# EAGLE design C64_Userport_Test (EAGLE 9.5.2)
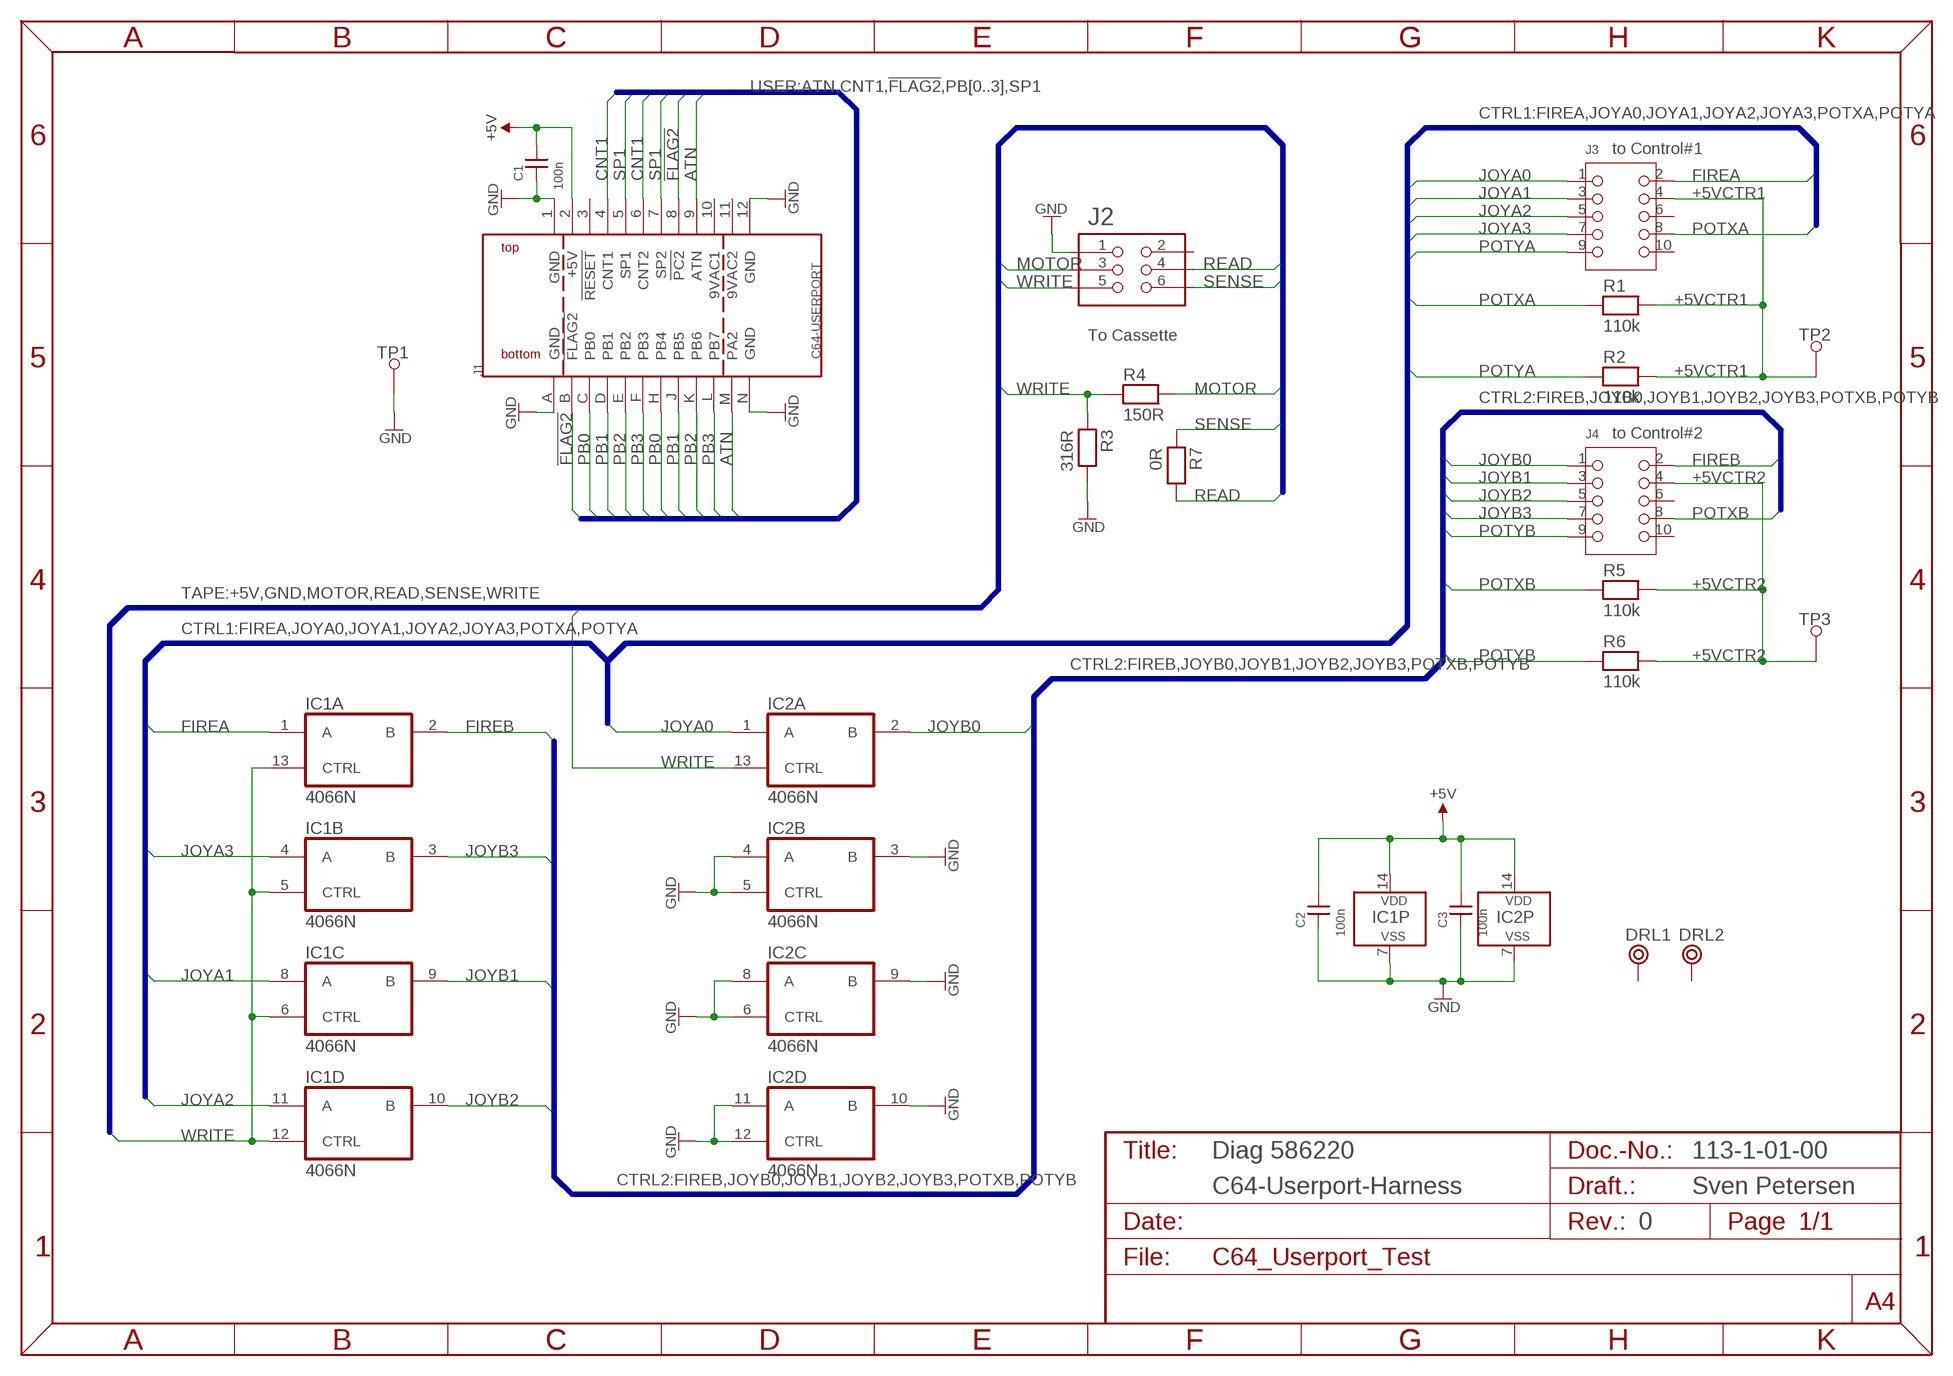
[diagram p0: schematic, sheet 1]

## Parts
C1  100n  CAP01  [C-2,5]
C2  100n  CAP01  [C-2,5]
C3  100n  CAP01  [C-2,5]
DRL1  BOHR3,2  [BOHR3,2]
DRL2  BOHR3,2  [BOHR3,2]
IC1  4066N  [DIL14]
IC2  4066N  [DIL14]
J1  C64-USERPORT  [USERPORT]
J2  2X03WV  [2X03WV]
J3  2X05WV  [2X05WV]
J4  2X05WV  [2X05WV]
R1  110k  RES04  [R-10]
R2  110k  RES04  [R-10]
R3  316R  RES04  [R-10]
R4  150R  RES04  [R-10]
R5  110k  RES04  [R-10]
R6  110k  RES04  [R-10]
R7  0R  RES04  [R-10]
TP1  L1,2_R  [1,2MM_R]
TP2  L1,2_R  [1,2MM_R]
TP3  L1,2_R  [1,2MM_R]

## Nets
!FLAG2: J1.8(!PC2) J1.B(!FLAG2)
+5V: C1.2 C2.2 C3.2 IC1.14(P:VDD) IC2.14(P:VDD) J1.2(+5V)
+5VCTR1: J3.4 R1.2 R2.2 TP2.1
+5VCTR2: J4.4 R5.2 R6.2 TP3.1
ATN: J1.9(ATN) J1.M(PA2)
CNT1: J1.4(CNT1) J1.6(CNT2)
FIREA: IC1.1(A:A) J3.2
FIREB: IC1.2(A:B) J4.2
GND: C1.1 C2.1 C3.1 IC1.7(P:VSS) IC2.3(B:B) IC2.4(B:A) IC2.5(B:CTRL) IC2.6(C:CTRL) IC2.7(P:VSS) IC2.8(C:A) IC2.9(C:B) IC2.10(D:B) IC2.11(D:A) IC2.12(D:CTRL) J1.1(GND) J1.12(GND) J1.A(GND) J1.N(GND) J2.1 R3.2 TP1.1
JOYA0: IC2.1(A:A) J3.1
JOYA1: IC1.8(C:A) J3.3
JOYA2: IC1.11(D:A) J3.5
JOYA3: IC1.4(B:A) J3.7
JOYB0: IC2.2(A:B) J4.1
JOYB1: IC1.9(C:B) J4.3
JOYB2: IC1.10(D:B) J4.5
JOYB3: IC1.3(B:B) J4.7
MOTOR: J2.3 R4.2
PB0: J1.C(PB0) J1.H(PB4)
PB1: J1.D(PB1) J1.J(PB5)
PB2: J1.E(PB2) J1.K(PB6)
PB3: J1.F(PB3) J1.L(PB7)
POTXA: J3.8 R1.1
POTXB: J4.8 R5.1
POTYA: J3.9 R2.1
POTYB: J4.9 R6.1
READ: J2.4 R7.2
SENSE: J2.6 R7.1
SP1: J1.5(SP1) J1.7(SP2)
WRITE: IC1.5(B:CTRL) IC1.6(C:CTRL) IC1.12(D:CTRL) IC1.13(A:CTRL) IC2.13(A:CTRL) J2.5 R3.1 R4.1
Unconnected: DRL1.P$1 DRL2.P$1 J1.3(!RESET) J2.2 J3.6 J3.10 J4.6 J4.10

## Buses
USER:ATN,CNT1,!FLAG2,PB[0..3],SP1
TAPE:+5V,GND,MOTOR,READ,SENSE,WRITE
CTRL1:FIREA,JOYA0,JOYA1,JOYA2,JOYA3,POTXA,POTYA
CTRL2:FIREB,JOYB0,JOYB1,JOYB2,JOYB3,POTXB,POTYB

## Notes on the sheet
- to Control#1
- To Cassette
- to Control#2
- Diag 586220 | 113-1-01-00
- C64-Userport-Harness | Sven Petersen
- 0

## Power pins joined to a net without a drawn wire
9VAC1: J1.10(9VAC1)
9VAC2: J1.11(9VAC2)

## Library data of the parts
C1-C3 = DISCRETE:CAP01
DRL1 DRL2 = Mech_Bohr:BOHR3,2
IC1 IC2 = 40xx:4066: Quad bilateral ANALOG SWITCH
J1 = Commodore:C64-USERPORT
J2 = PINHEAD:2X03WV
J3 J4 = PINHEAD:2X05WV
R1-R7 = DISCRETE:RES04
TP1-TP3 = Pads:L1,2_R

## Board
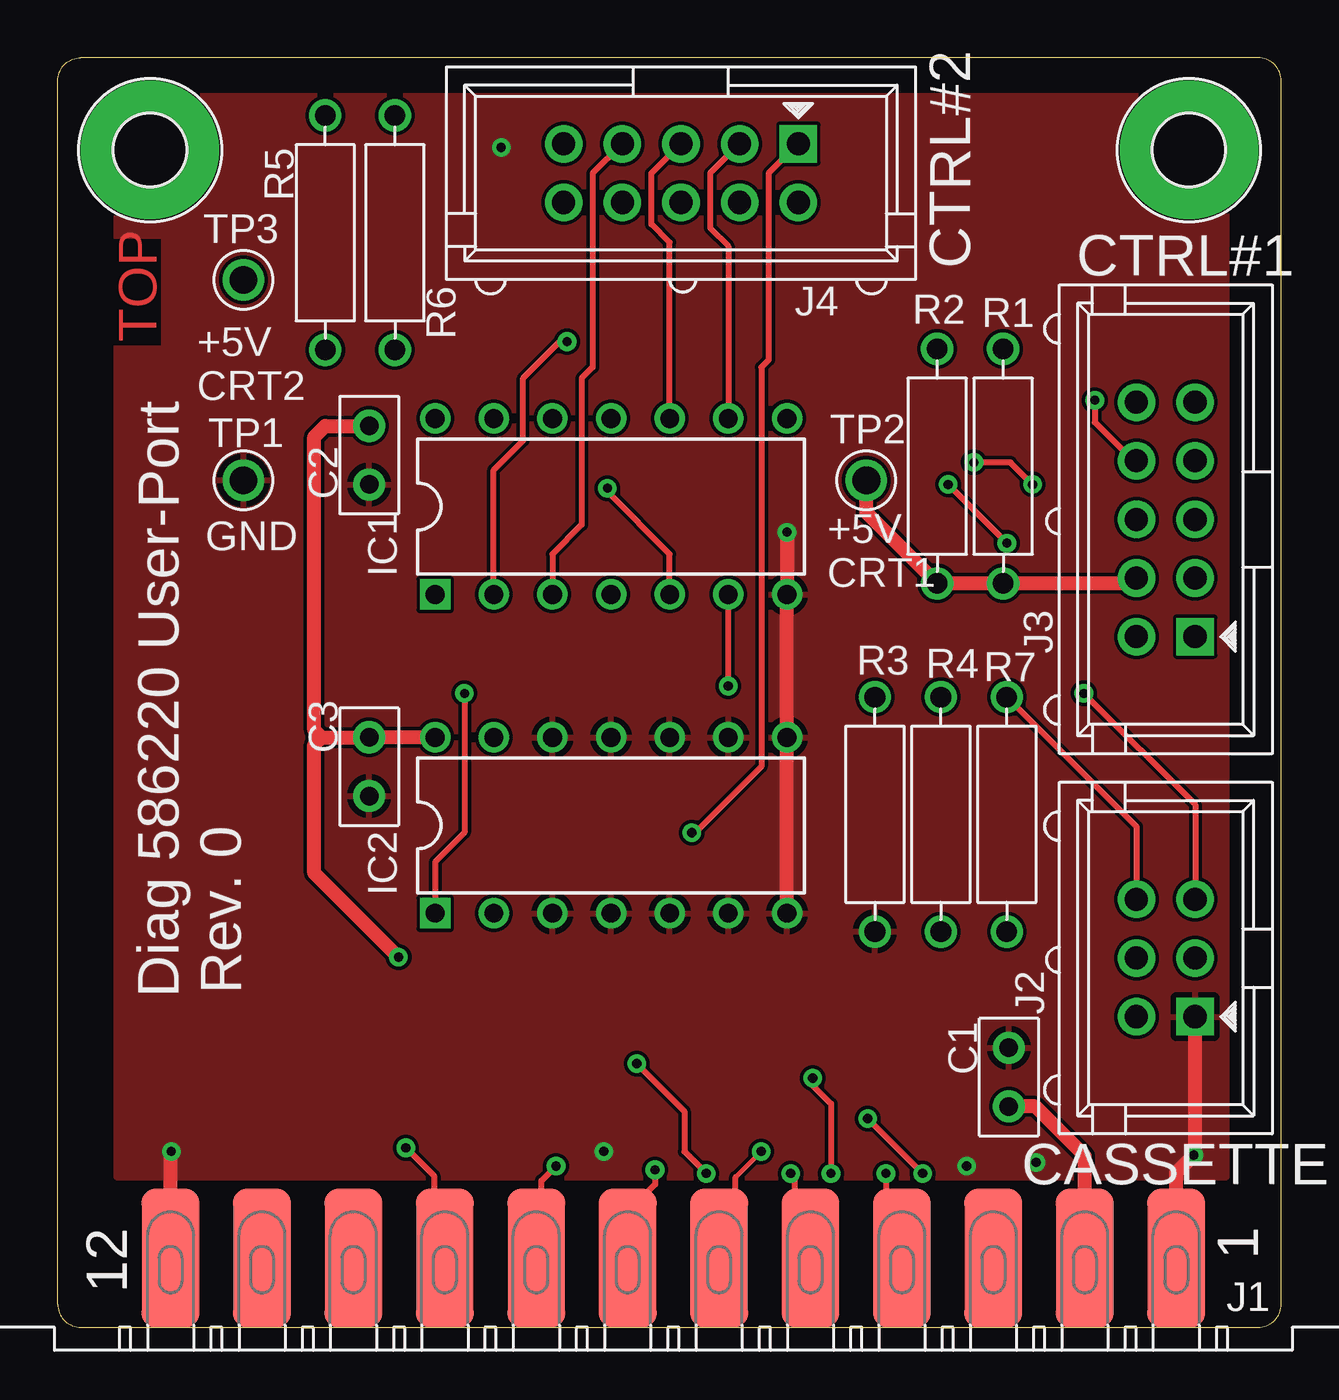
[diagram p1: board, top side]
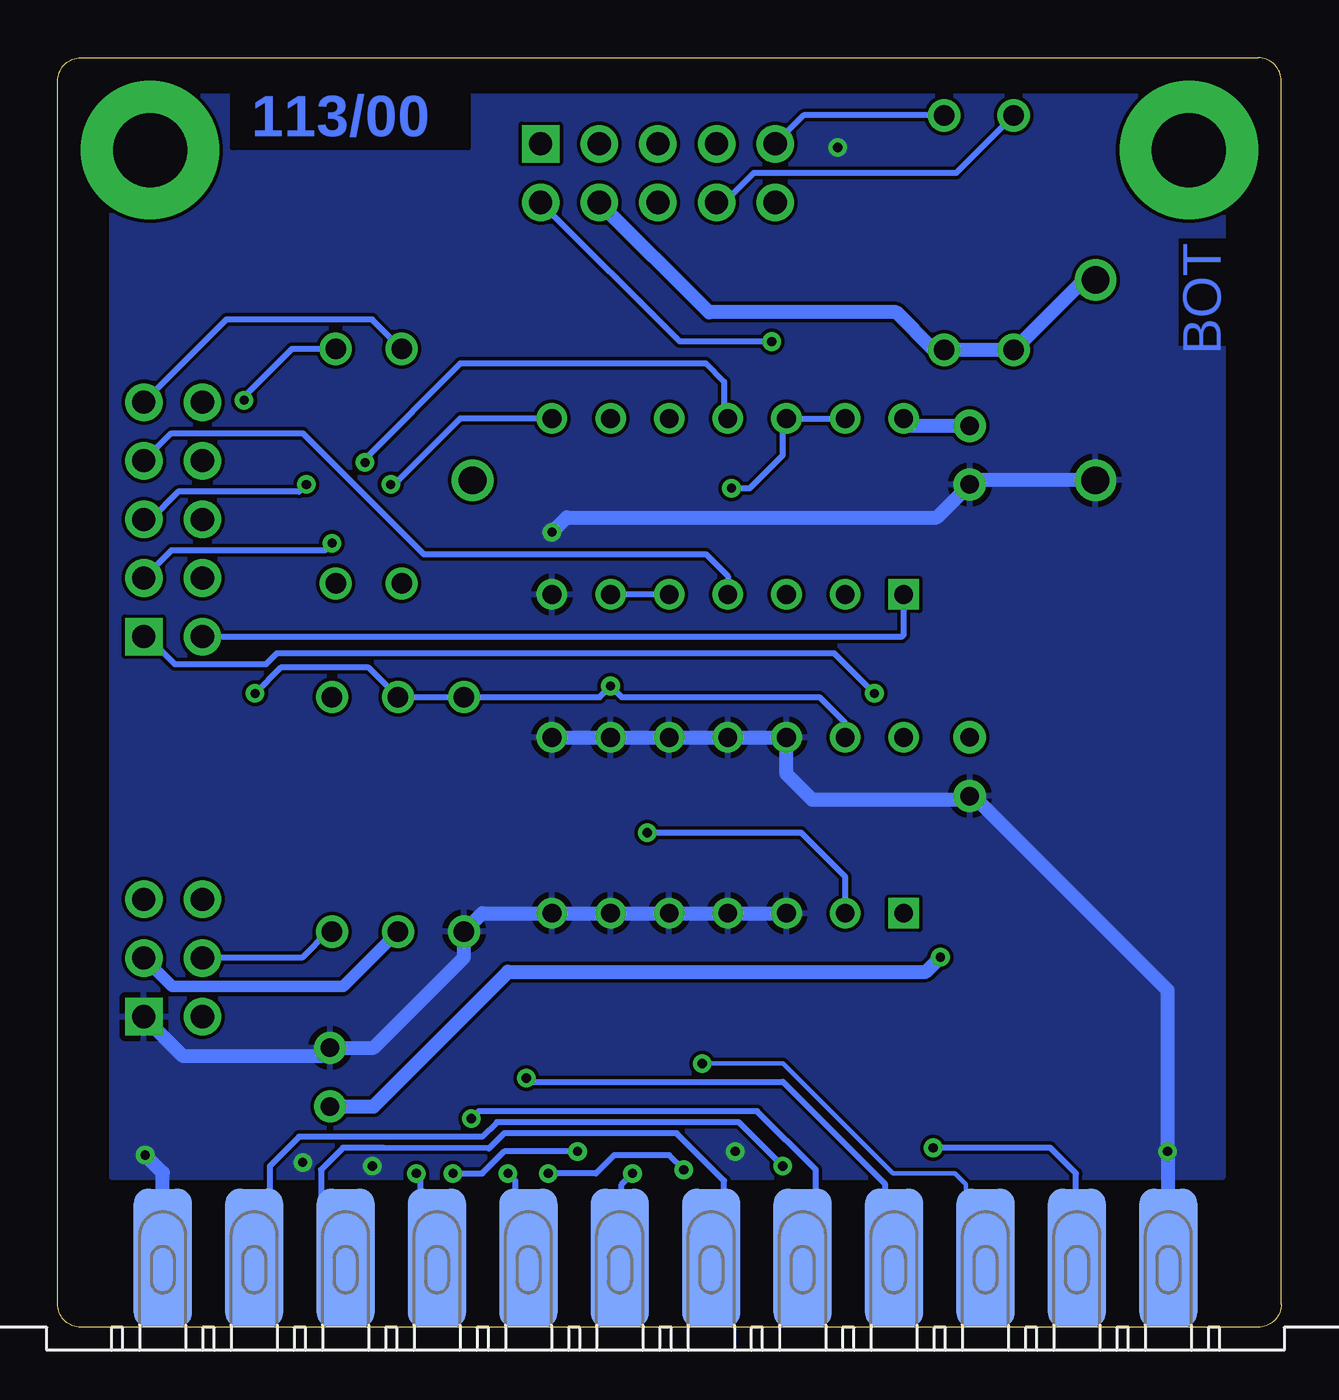
[diagram p2: board, bottom side, seen from below]

Size 53 x 55 mm. Coordinates in mm from the lower left corner, seen from the top.
Outline: 0,1 0,54 arc-90 1,55 52,55 arc-90 53,54 53,1 arc-90 52,0 1,0 arc-90 0,1
Copper layers (1*16): Top 0.035mm / dielectric 1.5mm / Bottom 0.035mm
Design rules "default *": minimum track width 6mil, minimum drill 0.35mm, track to track 6mil, track to pad 6mil, pad to pad 6mil, via to via 6mil, smd to smd 6mil, copper to edge 40mil, drill to drill 6mil, minimum pad ring 10mil, minimum via ring 8mil, stop-mask expansion 4mil, vias tented up to drill 24mil, thermal gap 10mil
bRestrict: 3 lines

### Footprints (pad centres in the part's own frame; a part is rotated, then mirrored left to right if it is on the bottom)
C-2,5 = drill 0.8 pad 1.397: 1 -1.27,0; 2 1.27,0
BOHR3,2 = drill 3.2 pad 6: P$1 0,0
DIL14 = drill 0.813 square: 1 -7.62,-3.81 | drill 0.813: 2 -5.08,-3.81; 3 -2.54,-3.81; 4 0,-3.81; 5 2.54,-3.81; 6 5.08,-3.81; 7 7.62,-3.81; 8 7.62,3.81; 9 5.08,3.81; 10 2.54,3.81; 11 0,3.81; 12 -2.54,3.81; 13 -5.08,3.81; 14 -7.62,3.81
USERPORT = smd 2.5 x 6: 1 -21.78,-3; 2 -17.82,-3; 3 -13.86,-3; 4 -9.9,-3; 5 -5.94,-3; 6 -1.98,-3; 7 1.98,-3; 8 5.94,-3; 9 9.9,-3; 10 13.86,-3; 11 17.82,-3; 12 21.78,-3 | smd 2.5 x 6 bottom: A -21.78,-3; B -17.82,-3; C -13.86,-3; D -9.9,-3; E -5.94,-3; F -1.98,-3; H 1.98,-3; J 5.94,-3; K 9.9,-3; L 13.86,-3; M 17.82,-3; N 21.78,-3
2X03WV = drill 1 pad 1.626 square: 1 -2.54,-1.27 | drill 1 pad 1.626: 2 -2.54,1.27; 3 0,-1.27; 4 0,1.27; 5 2.54,-1.27; 6 2.54,1.27
2X05WV = drill 1 pad 1.626 square: 1 -5.08,-1.27 | drill 1 pad 1.626: 2 -5.08,1.27; 3 -2.54,-1.27; 4 -2.54,1.27; 5 0,-1.27; 6 0,1.27; 7 2.54,-1.27; 8 2.54,1.27; 9 5.08,-1.27; 10 5.08,1.27
R-10 = drill 0.889 pad 1.397: 1 -5.08,0; 2 5.08,0
1,2MM_R = drill 1.2: 1 0,0

### Placement (x,y rotation side)
C1  41.2,10.84 270 top
C2  13.49,37.78 90 top
C3  13.49,24.29 90 top
DRL1  4,51 0 top
DRL2  49,51 0 top
IC1  23.97,35.56 0 top
IC2  23.97,21.75 0 top
J1  26.67,0 180 top
J2  48,16 90 top
J3  48,35 90 top
J4  27,50 180 top
R1  40.96,37.31 270 top
R2  38.1,37.31 270 top
R3  35.4,22.23 270 top
R4  38.26,22.23 270 top
R5  11.59,47.42 270 top
R6  14.61,47.42 270 top
R7  41.12,22.23 270 top
TP1  8.05,36.69 0 top
TP2  35.03,36.7 0 top
TP3  8.04,45.37 0 top
U$17  [2LAYER]  4.29,42.7 90 top
U$18  [PCB-TITLE/]  0,64 0 top  (outside the outline)

### Tracks (layer width: path | path; a pad name or v marks a point on that pad's centre or on a via)
!FLAG2  (via drill 0.4)
  Top 0.254: J1.8 20.95,3.23 20.95,6.35 v21.59,6.99
  Bottom 0.254: v21.59,6.99 23.5,8.89 33.97,8.89 34.61,8.26 42.55,8.26 43.81,6.99 43.81,3.67 J1.B
+5V  (via drill 0.4)
  Top 0.61: J1.2 44.49,7.42 42.34,9.57 C1.2 | v14.76,16.03 11.11,19.68 11.11,25.24 11.43,25.56 | 11.43,25.56 11.11,25.88 11.11,38.58 11.59,39.05 C2.2 | 11.43,25.56 C3.2 IC2.14
  Bottom 0.61: C1.2 39.33,9.57 33.5,15.4 15.4,15.4 v14.76,16.03 | C2.2 16.03,39.05 IC1.14
+5VCTR1
  Top 0.61: J3.4 46.5,32.23 R1.2 R2.2 35.03,35.3 TP2.1
+5VCTR2
  Bottom 0.254: R6.2 15.03,42.34
  Bottom 0.61: R6.2 R5.2 8.55,45.37 TP3.1 | 15.03,42.34 16.67,43.97 24.78,43.97 J4.4
ATN  (via drill 0.4)
  Top 0.254: v15.08,7.78 16.29,6.57 16.29,3.48 J1.9
  Bottom 0.254: J1.M 8.89,3.04 8.89,6.67 10,7.78 v15.08,7.78
CNT1  (via drill 0.4)
  Top 0.203: 29.37,6.51 v30.48,7.62
  Top 0.254: v35.88,6.67 35.88,3.81 36.57,3.12 J1.4 | J1.6 29.37,3.72 29.37,6.51
  Bottom 0.254: v35.88,6.67 34.61,6.67 33.66,7.62 v30.48,7.62
FIREA
  Bottom 0.254: J3.2 16.43,29.92 16.35,30 IC1.1
FIREB  (via drill 0.4)
  Top 0.254: IC1.2 18.89,37.15 20.16,38.42 20.16,41.12 21.75,42.7 v22.07,42.7
  Bottom 0.254: v22.07,42.7 26.05,42.7 J4.2
GND  (via drill 0.4)
  Top 0.61: J1.A 48.45,6.7 v49.21,7.46 49.27,7.52 J2.1 | IC2.7 IC2.8 IC1.7 v31.59,34.45 | J1.12 4.89,7.59 v4.92,7.62
  Bottom 0.61: J1.A 48.45,6.7 v49.21,7.46 | J2.1 47.56,11.75 41.59,11.75 41.23,12.11 C1.1 39.33,12.11 35.4,16.03 R3.2 34.61,17.94 IC2.7 IC2.6 IC2.5 IC2.4 IC2.3 | IC2.8 IC2.9 IC2.10 IC2.11 IC2.12 21.43,23.97 20.32,22.86 13.65,22.86 C3.1 13.34,23.02 4.92,14.61 v4.92,7.62 4.89,7.59 J1.12 5.08,2.81 | v31.59,34.45 30.96,35.08 14.92,35.08 C2.1 13.31,36.69 TP1.1
  other vias: 19.21,51.12 42.39,7.14 39.37,6.99 23.65,7.62
  pour Top: 2.54,6.51 50.64,6.51 50.64,53.34 2.54,53.34
  pour Bottom: 2.54,6.51 50.64,6.51 50.64,53.34 2.54,53.34
JOYA0  (via drill 0.4)
  Top 0.254: v17.62,27.46 17.62,21.43 16.35,20.16 IC2.1
  Bottom 0.254: J3.1 49.11,29.92 47.92,28.73 43.97,28.73 43.5,29.21 19.37,29.21 v17.62,27.46
JOYA1  (via drill 0.4)
  Top 0.254: v38.58,36.51 v41.12,33.97
  Bottom 0.254: IC1.8 35.56,39.37 38.42,36.51 v38.58,36.51 | v41.12,33.97 41.43,33.66 48.08,33.66 J3.3
JOYA2  (via drill 0.4)
  Top 0.254: v42.23,36.51 41.27,37.47 v39.69,37.47
  Bottom 0.254: IC1.11 24.13,39.53 24.13,40.96 24.92,41.75 35.56,41.75 39.69,37.62 v39.69,37.47 | v42.23,36.51 42.55,36.2 47.78,36.2 48.98,35 J3.5
JOYA3
  Bottom 0.254: J3.7 48.08,38.73 42.39,38.73 37.15,33.5 24.92,33.5 23.97,32.54 IC1.4
JOYB0  (via drill 0.4)
  Top 0.254: J4.1 30.8,49.99 30.8,41.91 30.48,41.59 30.48,24.29 27.62,21.43 v27.46,21.43
  Bottom 0.254: v27.46,21.43 20.8,21.43 18.89,19.53 IC2.2
JOYB1
  Top 0.254: J4.3 28.26,49.99 28.26,47.62 29.05,46.83 IC1.9
JOYB2
  Top 0.254: IC1.10 26.51,46.99 25.72,47.78 25.72,49.99 J4.5
JOYB3
  Top 0.254: J4.7 23.18,49.99 23.18,41.59 22.7,41.12 22.7,34.77 21.43,33.5 IC1.3
MOTOR
  Bottom 0.508: J2.3 48.03,14.76 40.64,14.76 R4.2
PB0
  Bottom 0.254: 24.69,5.16 J1.H 24.69,4.68 24.13,5.24 24.13,6.36 26.19,8.41 33.66,8.41 34.32,7.75 38.89,7.78 40.64,7.78 41.59,6.83 41.59,5.4 40.53,4.33 J1.C
PB1  (via drill 0.4)
  Top 0.254: v37.47,6.67 v35.08,9.05
  Bottom 0.254: J1.J 20.73,4.83 20.16,5.4 20.16,6.83 22.7,9.37 34.77,9.37 v35.08,9.05 | v37.47,6.67 37.31,6.51 37.31,3.33 36.97,3 J1.D
PB2  (via drill 0.4)
  Top 0.254: v32.7,10.79 32.7,10.48 33.5,9.68 v33.5,6.67
  Bottom 0.254: J1.K 17.14,3.38 17.14,6.19 21.59,10.64 32.54,10.64 v32.7,10.79 | v33.5,6.67 33.18,6.35 33.18,3.33 32.84,3 J1.E
PB3  (via drill 0.4)
  Top 0.254: v28.1,6.67 27.15,7.62 27.15,9.37 v25.08,11.43
  Bottom 0.203: J1.L 13.65,3.84 13.65,6.19 14.13,6.67 16.83,6.67 21.59,11.43 v25.08,11.43
  Bottom 0.254: v28.1,6.67 28.57,6.19 28.57,5.56 28.65,5.48 J1.F
POTXA  (via drill 0.4)
  Top 0.254: v44.93,40.16 44.93,39.21 46.6,37.54 J3.8
  Bottom 0.254: R1.1 42.86,42.39 44.93,40.32 v44.93,40.16
POTXB
  Bottom 0.254: R5.1 14.08,50.01 22.86,50.01 24.14,48.73 J4.8
POTYA
  Bottom 0.254: R2.1 39.37,43.66 45.69,43.66 J3.9
POTYB
  Bottom 0.254: R6.1 20.69,52.5 J4.9
READ
  Bottom 0.254: J2.4 46.7,16.03 42.39,16.03 41.27,17.14 R7.2
SENSE
  Top 0.254: R7.1 46.73,21.69 J2.6
SP1  (via drill 0.4)
  Top 0.254: J1.7 24.69,5.64 24.77,5.71 25.4,5.71 25.88,6.19 v25.88,6.83 | v31.75,6.67 31.91,6.51 31.91,3.7 J1.5
  Bottom 0.254: v25.88,6.83 26.51,7.46 28.89,7.46 29.69,6.67 v31.75,6.67
WRITE  (via drill 0.4)
  Top 0.254: v29.05,27.78 IC1.6 | IC1.5 26.51,33.5 23.81,36.2 v23.81,36.35 | v44.45,27.46 49.27,22.64 J2.5
  Bottom 0.254: IC2.13 18.89,26.19 20,27.3 28.57,27.3 v29.05,27.78 29.53,27.3 R3.1 R4.1 39.53,28.57 43.34,28.57 v44.45,27.46 | IC1.5 IC1.6 | v23.81,36.35 23.02,36.35 21.59,37.78 21.59,39.21 IC1.12 IC1.13

### Text on the board
Bottom: 113/00
tPlace: CTRL#2 | CTRL#1 | +5V / CRT2 | GND | +5V / CRT1 | Diag 586220 User-Port | Rev. 0 | CASSETTE | 1 | 12
Document: 113/2/01/00 | Diag 586220 / Harness | 35µm | 2 | 0